# Altium schematic sheet cpu.SchDoc
size A3; PageSetup: Record=PageOptions|CenterHorizontal=True|CenterVertical=True|PrintScale=1.00|XCorrection=1.00|YCorrection=1.00|PrintKind=0|BorderSize=5000000|LeftOffset=0|BottomOffset=0|Orientation=2|PaperLength=1000|PaperWidth=1000|Scale=100|PaperSource=7|PrintQuality=-4|MediaType=1|DitherType=10|PaperKind=A4|PrintScaleMode=1
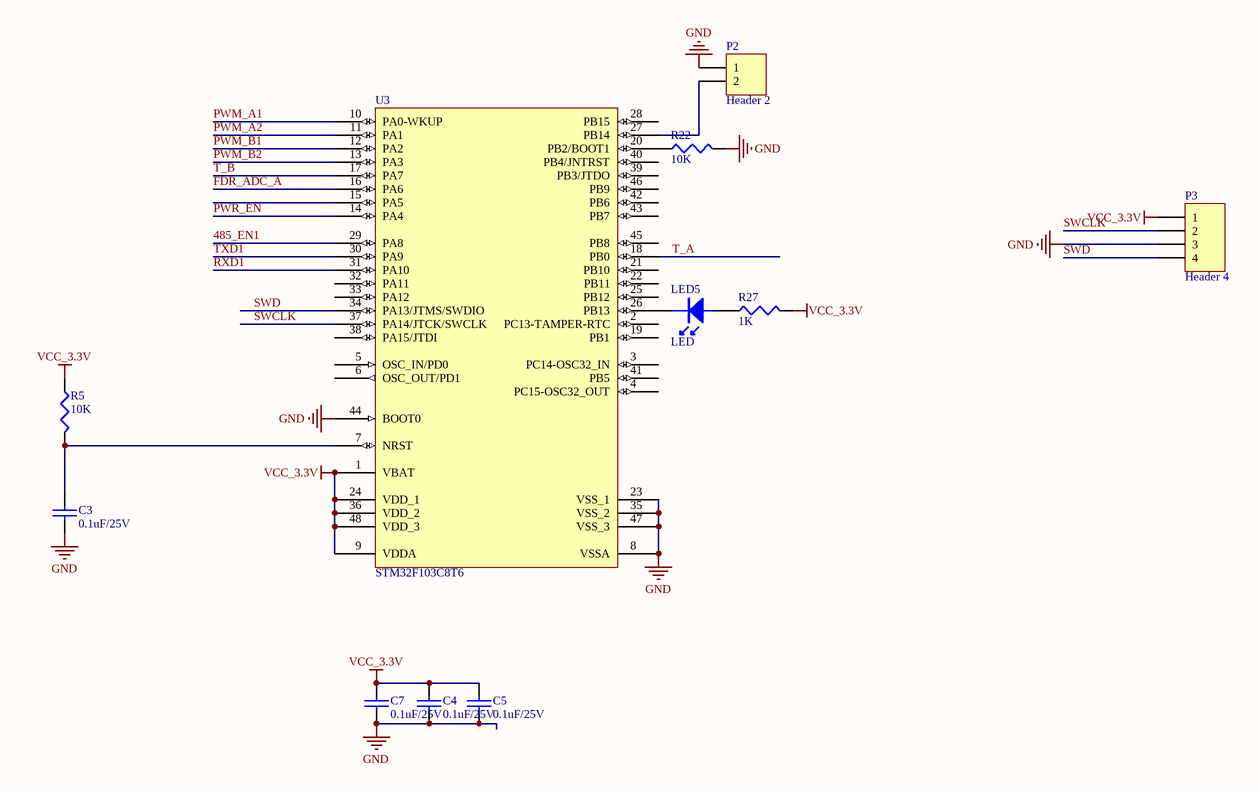
[diagram p0: cpu.SchDoc]

## Parts
C3  0.1uF/25V  [0603C]
C4  0.1uF/25V  [0603C]
C5  0.1uF/25V  [0603C]
C7  0.1uF/25V  [0603C]
LED5  LED  [0603LED]
P2  Header 2  [HDR1X2]
P3  Header 4  [HDR1X4]
R5  10K  [0603R]
R22  10K  [0603R]
R27  1K  [0603R]
U3  STM32F103C8T6  [TQFP-48]

## Nets
GND: C3.1 C4.1 C5.1 C7.1 P2.1 P3.3 R22.2 U3.8(VSSA) U3.23(VSS_1) U3.35(VSS_2) U3.44(BOOT0) U3.47(VSS_3)
VCC_3.3V: C4.2 C5.2 C7.2 P3.1 R5.1 R27.2 U3.1(VBAT) U3.9(VDDA) U3.24(VDD_1) U3.36(VDD_2) U3.48(VDD_3)
485_EN1: U3.29(PA8)
FDR_ADC_A: U3.16(PA6)
PWM_A1: U3.10(PA0-WKUP)
PWM_A2: U3.11(PA1)
PWM_B1: U3.12(PA2)
PWM_B2: U3.13(PA3)
PWR_EN: U3.14(PA4)
RXD1: U3.31(PA10)
SWCLK: P3.2 U3.37(PA14/JTCK/SWCLK)
SWD: P3.4 U3.34(PA13/JTMS/SWDIO)
T_A: U3.18(PB0)
T_B: U3.17(PA7)
TXD1: U3.30(PA9)
NetC3_2: C3.2 R5.2 U3.7(NRST)
NetLED5_1: LED5.1 R27.1
NetLED5_2: LED5.2 U3.26(PB13)
NetP2_2: P2.2 U3.27(PB14)
NetR22_1: R22.1 U3.20(PB2/BOOT1)

Not connected (* = marked no-connect by the designer): U3 2(PC13-TAMPER-RTC) 3(PC14-OSC32_IN) 4(PC15-OSC32_OUT) 5(OSC_IN/PD0) 6(OSC_OUT/PD1) 15(PA5) 19(PB1) 21(PB10) 22(PB11) 25(PB12) 28(PB15) 32(PA11) 33(PA12) 38(PA15/JTDI) 39(PB3/JTDO) 40(PB4/JNTRST) 41(PB5) 42(PB6) 43(PB7) 45(PB8) 46(PB9)

## Library data of the parts
C3-C5 C7 = CAP: Capacitor
P2 = Header 2: Header, 2-Pin; LatestRevisionDate: 17-Jul-2002; LatestRevisionNote: Re-released for DXP Platform.; Publisher: Altium Limited
P3 = Header 4: Header, 4-Pin; LatestRevisionDate: 17-Jul-2002; LatestRevisionNote: Re-released for DXP Platform.; Publisher: Altium Limited
R5 R22 = Res3: Resistor; Published: 8-Jun-2000; LatestRevisionDate: 29-May-2009; LatestRevisionNote: IPC-7351 Footprint Added.; PackageReference: J1-0603; Publisher: Altium Limited; PackageDescription: Chip Resistor
R27 = RES1: P: 1/8W
U3 = STM32F103C8T6: STM32 ARM-based 32-bit MCU with 64 Kbytes Flash, 48-pin LQFP, Industrial Temperature; Published: 30-May-2008; DatasheetVersion: rev6, Mar-2008; PackageVersion: Mar-2008; PackageReference: LQFP48; Publisher: Altium Limited; PackageDescription: 48-Pin Low-Profile Quad Flat Pack, 7 x 7 mm Body, 0.5 mm Pitch (LQFP48); ComponentLink1Description: Manufacturer Link; ComponentLink1URL: www.st.com/stm32; ComponentLink2Description: Datasheet; ComponentLink2URL: http://www.st.com/stonline/products/literature/ds/13587.pdf